# Altium project PCB_Interface_Inverter_UZ.PrjPcb
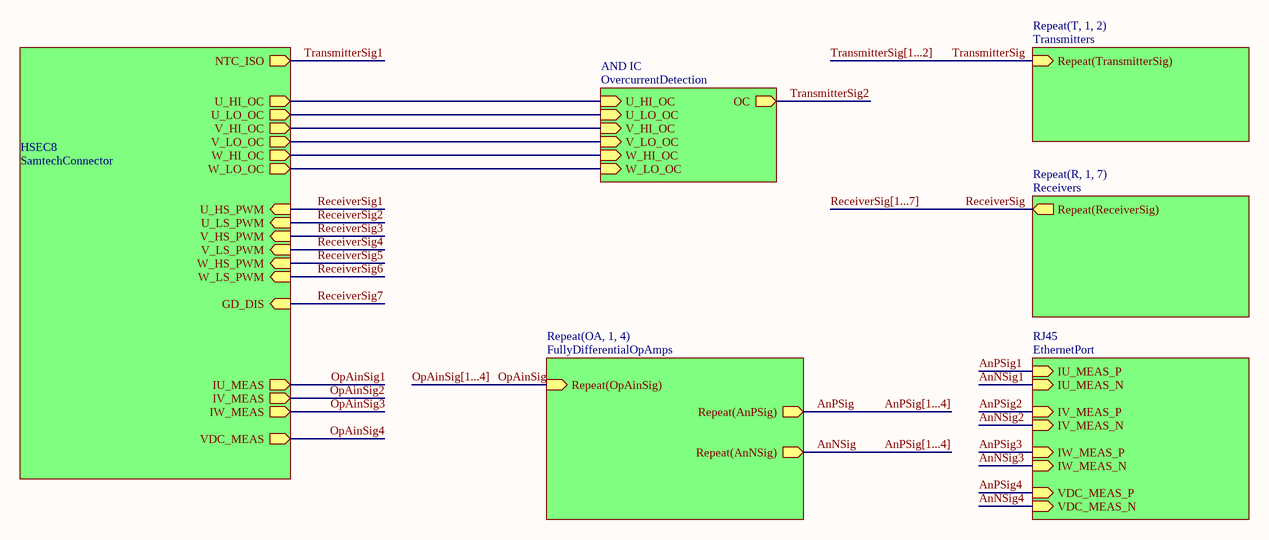
[diagram p0: TopSheet.SchDoc]
7 sheets, 111 parts. Net scope: hierarchical (ports join the sheet entries above them; power ports are global).
Board file: PCB.PcbDoc
Sheets:
  TopSheet.SchDoc
    HSEC8 = SamtechConnector.SchDoc
    OA1 = FullyDifferentialOpAmps.SchDoc
    OA2 = FullyDifferentialOpAmps.SchDoc
    OA3 = FullyDifferentialOpAmps.SchDoc
    OA4 = FullyDifferentialOpAmps.SchDoc
    T1 = Transmitters.SchDoc
    T2 = Transmitters.SchDoc
    AND IC = OvercurrentDetection.SchDoc
    R1 = Receivers.SchDoc
    R2 = Receivers.SchDoc
    R3 = Receivers.SchDoc
    R4 = Receivers.SchDoc
    R5 = Receivers.SchDoc
    R6 = Receivers.SchDoc
    R7 = Receivers.SchDoc
    RJ45 = EthernetPort.SchDoc

## Sheet TopSheet.SchDoc
size A4; SheetNumber: 1; SheetTotal: 7

### Sub-sheets
AND IC = OvercurrentDetection: U_HI_OC (in), U_LO_OC (in), V_HI_OC (in), V_LO_OC (in), W_HI_OC (in), OC (out), W_LO_OC (in)
HSEC8 = SamtechConnector: NTC_ISO (out), U_HI_OC (out), U_LO_OC (out), V_HI_OC (out), V_LO_OC (out), W_HI_OC (out), W_LO_OC (out), IU_MEAS (out), U_HS_PWM (in), U_LS_PWM (in), V_HS_PWM (in), V_LS_PWM (in), W_HS_PWM (in), W_LS_PWM (in), GD_DIS (in), IV_MEAS (out), IW_MEAS (out), VDC_MEAS (out)
Repeat(OA, 1, 4) = FullyDifferentialOpAmps: Repeat(OpAinSig) (in), Repeat(AnPSig) (out), Repeat(AnNSig) (out)
Repeat(R, 1, 7) = Receivers: Repeat(ReceiverSig) (out)
Repeat(T, 1, 2) = Transmitters: Repeat(TransmitterSig) (in)
RJ45 = EthernetPort: IU_MEAS_P (in), IU_MEAS_N (in), IV_MEAS_P (in), IV_MEAS_N (in), IW_MEAS_P (in), IW_MEAS_N (in), VDC_MEAS_P (in), VDC_MEAS_N (in)

### Nets
AnNSig: sheet Repeat(OA, 1, 4)/Repeat(AnNSig)  [also labelled AnPSig[1...4]]
AnPSig: sheet Repeat(OA, 1, 4)/Repeat(AnPSig)
OpAinSig: sheet Repeat(OA, 1, 4)/Repeat(OpAinSig)
ReceiverSig: sheet Repeat(R, 1, 7)/Repeat(ReceiverSig)
TransmitterSig: sheet Repeat(T, 1, 2)/Repeat(TransmitterSig)
NetJ1_79: sheet HSEC8/U_HI_OC, sheet AND IC/U_HI_OC
NetJ1_81: sheet HSEC8/U_LO_OC, sheet AND IC/U_LO_OC
NetJ1_91: sheet HSEC8/V_HI_OC, sheet AND IC/V_HI_OC
NetJ1_93: sheet HSEC8/V_LO_OC, sheet AND IC/V_LO_OC
NetJ1_99: sheet HSEC8/W_HI_OC, sheet AND IC/W_HI_OC
NetJ1_101: sheet HSEC8/W_LO_OC, sheet AND IC/W_LO_OC

### Buses and harness runs
bus AnPSig[1...4]
bus OpAinSig[1...4]
bus ReceiverSig[1...7]
bus TransmitterSig[1...2]

## Sheet SamtechConnector.SchDoc
size A4; SheetNumber: 3; SheetTotal: 7
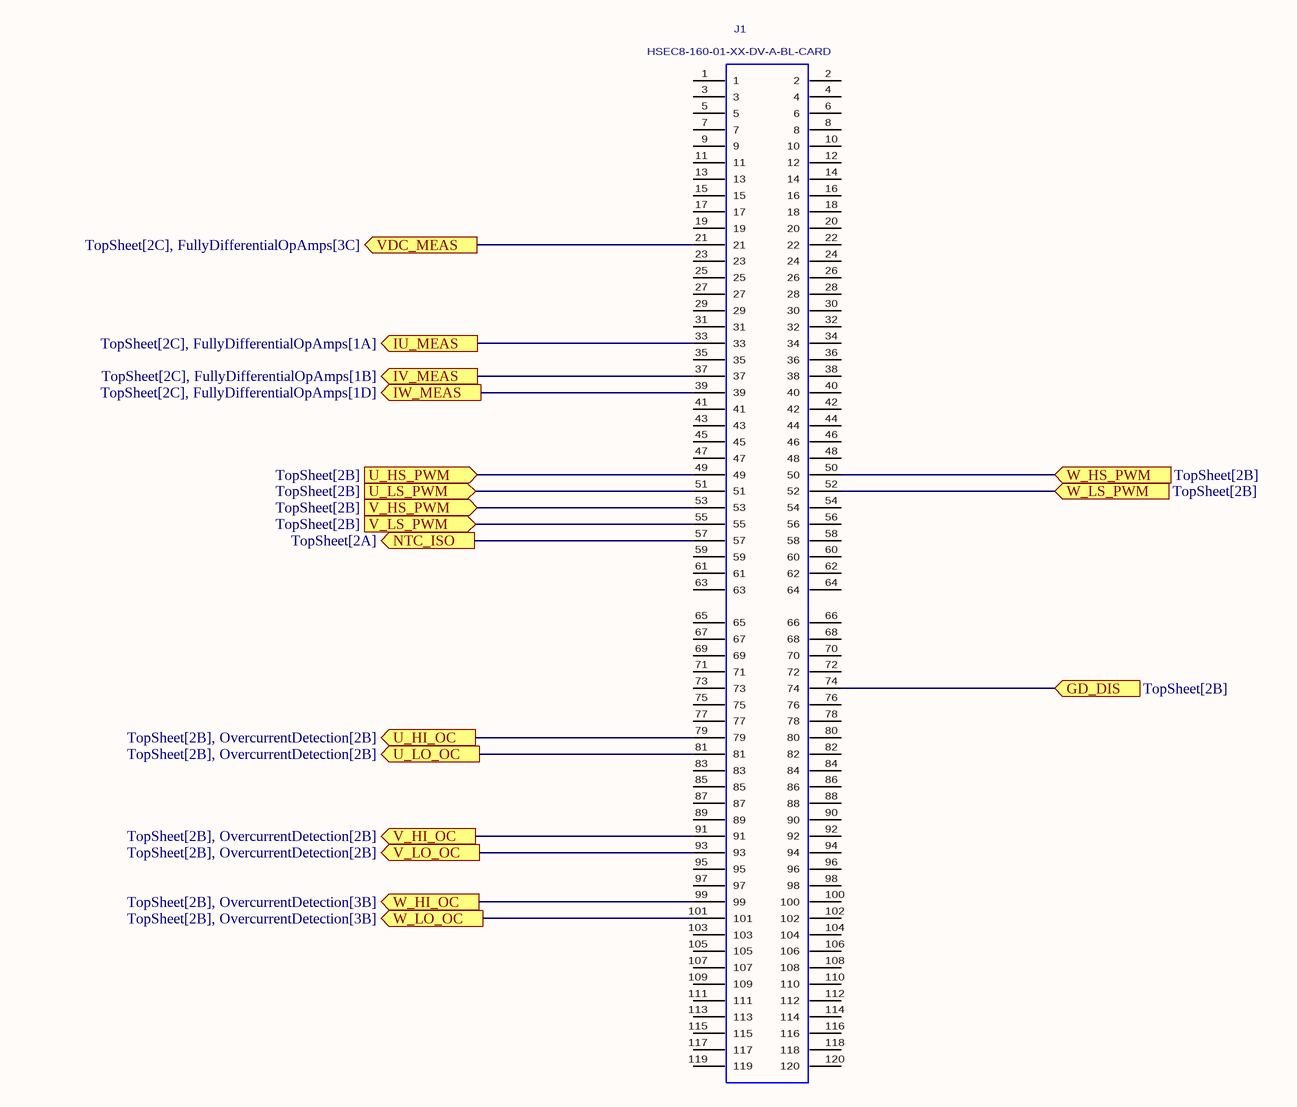
[diagram p1: SamtechConnector.SchDoc]

### Parts
J1  HSEC8-160-01-XX-DV-A-BL-CARD  [HSEC8-160-01-XX-DV-A-BL-CARD]

### Ports
GD_DIS (in, see TopSheet[2B]), IU_MEAS (out, see TopSheet[2C], FullyDifferentialOpAmps[1A]), IV_MEAS (out, see TopSheet[2C], FullyDifferentialOpAmps[1B]), IW_MEAS (out, see TopSheet[2C], FullyDifferentialOpAmps[1D]), NTC_ISO (out, see TopSheet[2A]), U_HI_OC (out, see TopSheet[2B], OvercurrentDetection[2B]), U_HS_PWM (in, see TopSheet[2B]), U_LO_OC (out, see TopSheet[2B], OvercurrentDetection[2B]), U_LS_PWM (in, see TopSheet[2B]), V_HI_OC (out, see TopSheet[2B], OvercurrentDetection[2B]), V_HS_PWM (in, see TopSheet[2B]), V_LO_OC (out, see TopSheet[2B], OvercurrentDetection[2B]), V_LS_PWM (in, see TopSheet[2B]), VDC_MEAS (out, see TopSheet[2C], FullyDifferentialOpAmps[3C]), W_HI_OC (out, see TopSheet[2B], OvercurrentDetection[3B]), W_HS_PWM (in, see TopSheet[2B]), W_LO_OC (out, see TopSheet[2B], OvercurrentDetection[3B]), W_LS_PWM (in, see TopSheet[2B])

### Nets
OpAinSig1: J1.33 ; port IU_MEAS
OpAinSig2: J1.37 ; port IV_MEAS
OpAinSig3: J1.39 ; port IW_MEAS
OpAinSig4: J1.21 ; port VDC_MEAS
ReceiverSig1: J1.49 ; port U_HS_PWM
ReceiverSig2: J1.51 ; port U_LS_PWM
ReceiverSig3: J1.53 ; port V_HS_PWM
ReceiverSig4: J1.55 ; port V_LS_PWM
ReceiverSig5: J1.50 ; port W_HS_PWM
ReceiverSig6: J1.52 ; port W_LS_PWM
ReceiverSig7: J1.74 ; port GD_DIS
TransmitterSig1: J1.57 ; port NTC_ISO
NetJ1_79: J1.79 ; port U_HI_OC
NetJ1_81: J1.81 ; port U_LO_OC
NetJ1_91: J1.91 ; port V_HI_OC
NetJ1_93: J1.93 ; port V_LO_OC
NetJ1_99: J1.99 ; port W_HI_OC
NetJ1_101: J1.101 ; port W_LO_OC

Not connected (* = marked no-connect by the designer): J1 1 2 3 4 5 6 7 8 9 10 11 12 13 14 15 16 17 18 19 20 22 23 24 25 26 27 28 29 30 31 32 34 35 36 38 40 41 42 43 44 45 46 47 48 54 56 58 59 60 61 62 63 64 65 66 67 68 69 70 71 72 73 75 76 77 78 80 82 83 84 85 86 87 88 89 90 92 94 95 96 97 98 100 102 103 104 105 106 107 108 109 110 111 112 113 114 115 116 117 118 119 120

### Library data of the parts
J1 = HSEC8-160-01-XX-DV-A-BL-CARD: MATING CARD LAYOUT FOR HSEC8-160-01-XX-DV-A-BL.; MANUFACTURER: SAMTEC; CREATED: April 20, 2018 - Wendy Xin; PCB DECAL: HSEC8-160-01-XX-DV-A-BL-CARD; Design Item ID: HSEC8-160-01-XX-DV-A-BL-CARD; Source: HSEC8-160-01-XX-DV-A-BL-CARD.SCHLIB; Component Type: Standard; Pin Count: 120

## Sheet FullyDifferentialOpAmps.SchDoc
size A4; SheetNumber: 2; SheetTotal: 7; SPICEModelCacheMURSBSRZ: <root> / <DocumentId>MURSBSRZ</DocumentId> / </root>
Used 4 times, as channels OA1, OA2, OA3, OA4. Parts and nets are listed once, with the designators drawn on the sheet.
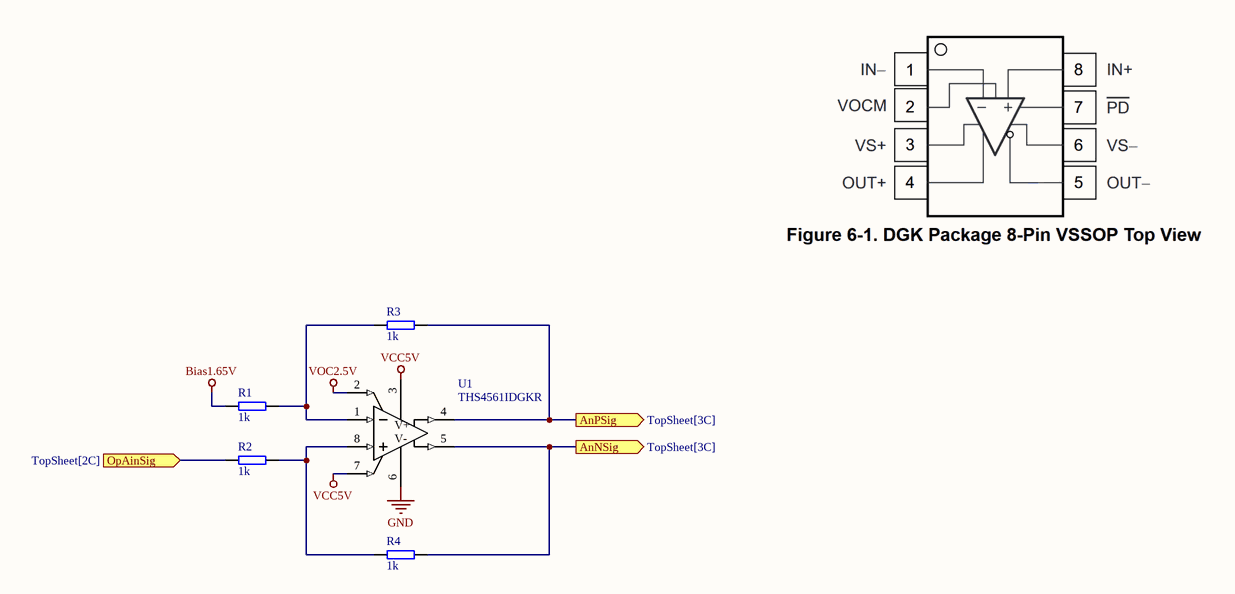
[diagram p2: FullyDifferentialOpAmps.SchDoc]

### Parts
R1  1k  [RES 0603_1608]
R2  1k  [RES 0603_1608]
R3  1k  [RES 0603_1608]
R4  1k  [RES 0603_1608]
U1  THS4561IDGKR  [DGK0008A_N]

### Ports
AnNSig (out, see TopSheet[3C]), AnPSig (out, see TopSheet[3C]), OpAinSig (in, see TopSheet[2C])

### Nets
Bias1.65V: R1.1
GND: U1.6(VS-)
VCC5V: U1.3(VS+) U1.7(PD_N)
VOC2.5V: U1.2(VOCM)
AnNSig: R4.2 U1.5(VOUT-) ; port AnNSig
AnPSig: R3.2 U1.4(VOUT+) ; port AnPSig
OpAinSig: R2.1 ; port OpAinSig
NetR1_2: R1.2 R3.1 U1.1(VIN-)
NetR2_2: R2.2 R4.1 U1.8(VIN+)

### Channels
OA1: designators end in _OA1; ports AnNSig=AnNSig1 AnPSig=AnPSig1 OpAinSig=OpAinSig1
OA2: designators end in _OA2; ports AnNSig=AnNSig2 AnPSig=AnPSig2 OpAinSig=OpAinSig2
OA3: designators end in _OA3; ports AnNSig=AnNSig3 AnPSig=AnPSig3 OpAinSig=OpAinSig3
OA4: designators end in _OA4; ports AnNSig=AnNSig4 AnPSig=AnPSig4 OpAinSig=OpAinSig4

### Notes on the sheet
- (in symbol CMP-020-000001-1) V+; V-

### Library data of the parts
R1-R4 = 0603WAF1001T5E: SMD resistor E24 series; Manufacturer: UNI-ROYAL; Tolerance: 1%; Created from: AGeiger; Manufacturer Part Number: 0603WAF1001T5E; PartID: 74; Created On: 14/12/2020 16:17:14; ComponentLink1Description: Datasheet; ComponentLink1URL: https://datasheet.lcsc.com/lcsc/2206010130_UNI-ROYAL-Uniroyal-Elec-0603WAF1001T5E_C21190.pdf; Component Type: SMD resistor; Device Package: 0603; Last Updated: 25/08/2022 16:01:46; Mounting Type: SMD; Supplier 1: LCSC; Supplier Part Number 1: C21190; Type: Resistor; Value: 1k; Live Cycle Status: 1; Stock number: Labor SMD Container; LCSC Part Number: C21190
U1 = CMP-020-000001-1: No Description Available; Mfr_Name: Texas Instruments; TYPE: TYPE; Source: THS4561IDGKR.SchLib; RefDes: RefDes; Design Item ID: THS4561IDGKR

## Sheet Transmitters.SchDoc
size A4; SheetNumber: 5; SheetTotal: 7
Used 2 times, as channels T1, T2. Parts and nets are listed once, with the designators drawn on the sheet.
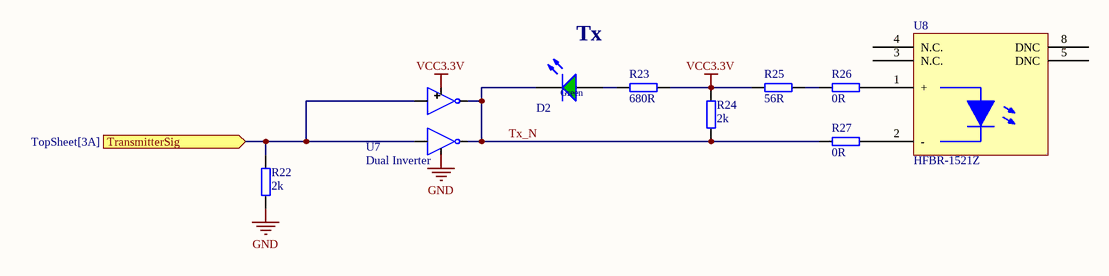
[diagram p3: Transmitters.SchDoc]

### Parts
D2  150060GS75000  [WL-SMCW_0603]  (value not drawn)
R22  2k  [R_0603_N]
R23  680R  [R_0603_N]
R24  2k  [R_0603_N]
R25  56R  [RES_2012X06N]
R26  0R  [R_0603_N]
R27  0R  [R_0603_N]
U7  Dual Inverter  [SN74LVC2GU04DCKR]
U8  HFBR-1521Z  [HFBRx5XX]

### Ports
TransmitterSig (in, see TopSheet[3A])

### Nets
GND: R22.1 U7.2(GND)
VCC3.3V: R23.1 R24.2 R25.1 U7.5(VCC)
TransmitterSig: R22.2 U7.1(IN1) U7.3(IN2) ; port TransmitterSig
Tx_N: D2.1(K) R24.1 R27.1 U7.4(OUT2) U7.6(OUT2)
NetD2_2: D2.2(A) R23.2
NetR25_2: R25.2 R26.1
NetR26_2: R26.2 U8.1(+)
NetR27_2: R27.2 U8.2(-)

Not connected (* = marked no-connect by the designer): U8 3(N.C.) 4(N.C.) 5(DNC) 8(DNC)

### Channels
T1: designators end in _T1; ports TransmitterSig=TransmitterSig1
T2: designators end in _T2; ports TransmitterSig=TransmitterSig2

### Notes on the sheet
- Tx

### Library data of the parts
D2 = LED_Green_0603: WL-SMCW SMD Mono-color Chip LED Waterclear, size 0603, Green, 3.2 V, 140°; Forward Voltage: 3.2 V; Luminous Intensity: 430 mcd; Peak Wavelength: 515 nm; Dominant Wavelength: 520 nm; MF: Wuerth Elektronik; Published Date: Sep. 2017; ComponentLink1Description: Manufacturer; ComponentLink1URL: http://www.we-online.de; ComponentLink2Description: Datasheet; ComponentLink2URL: http://katalog.we-online.com/led/datasheet/150060GS75000.pdf; MPN: 150060GS75000; Size: 0603; Viewing Angle: 140°; Emitting Color: Green; Value: 150060GS75000; Package: 0603; Created: 2018_09_06_AGeiger; Supplier 1: Farnell; Supplier Part Number 1: 2322070; Supplier 2: Mouser; Supplier Part Number 2: 710-150060GS75000; Supplier 3: Digi-Key; Supplier Part Number 3: 732-4971-1-ND; LCSC Part #: C72043
R22 R24 = R_0603: SMD Resistor 0603; MPN: RC0603FR-072KL; Tolerance: 1%; Voltage: 75 V; Power: 100 mW; MF: Yageo; Package: 0603; Value: 2k; Created: 2018_09_06_AGeiger; Supplier 1: Mouser; Supplier Part Number 1: 603-RC0603FR-072KL; LCSC Part #: C22975
R23 = R_0603: SMD Resistor 0603; MPN: CR0603-FX-3901ELF; Tolerance: 1%; Voltage: 75V; Power: 100 mW; MF: Bourns; Package: 0603; Value: 680R; Created: 2018_09_06_AGeiger; Supplier 1: Mouser; Supplier Part Number 1: 652-CR0603-FX3901ELF; LCSC Part #: C23228
R25 = R_0805: SMD Resistor 0805; MPN: CR0805-FX-1200ELF; Case_EIA: 0805; MF: Bourns; Voltage: 150 V; Power: 125 mW; Tolerance: 1%; Value: 56R; Supplier 1: Mouser; Supplier Part Number 1: 652-CR0805FX-1200ELF*; LCSC Part #: C17437
R26 R27 = R_0603_JLC: SMD Resistor 0603; Tolerance: 1%; Voltage: 75V; Power: 100 mW; Package: 0603; Value: 0R; Created: 2018_09_06_AGeiger; Supplier 1: Mouser; Supplier Part Number 1: 71-CRCW06030000Z0EBC; LCSC Part #: C21189
U7 = SN74LVC2GU04DCKR: This dual inverter is designed for 1.65-V to 5.5-V VCC / operation.; LCSC Part #: C116660; JLCSMT Rotation: 180
U8 = CMP-017-000002-1: Fibre Optic Transmitters, Link Horiz 5MBd Tx RoHS; MF: Broadcom/Avago; Supply Voltage: 5V; Wavelength: 660 nm; Foreward Current: 60 mA; Created: 2019_04_09_Kreppel; Data Rate: 5 MBd; Design Item ID: HFBR-1521Z; MPN: HFBR-1521Z; Source: UZOhm_Optical.SchLib

## Sheet OvercurrentDetection.SchDoc
size A4; SheetNumber: 7; SheetTotal: 7
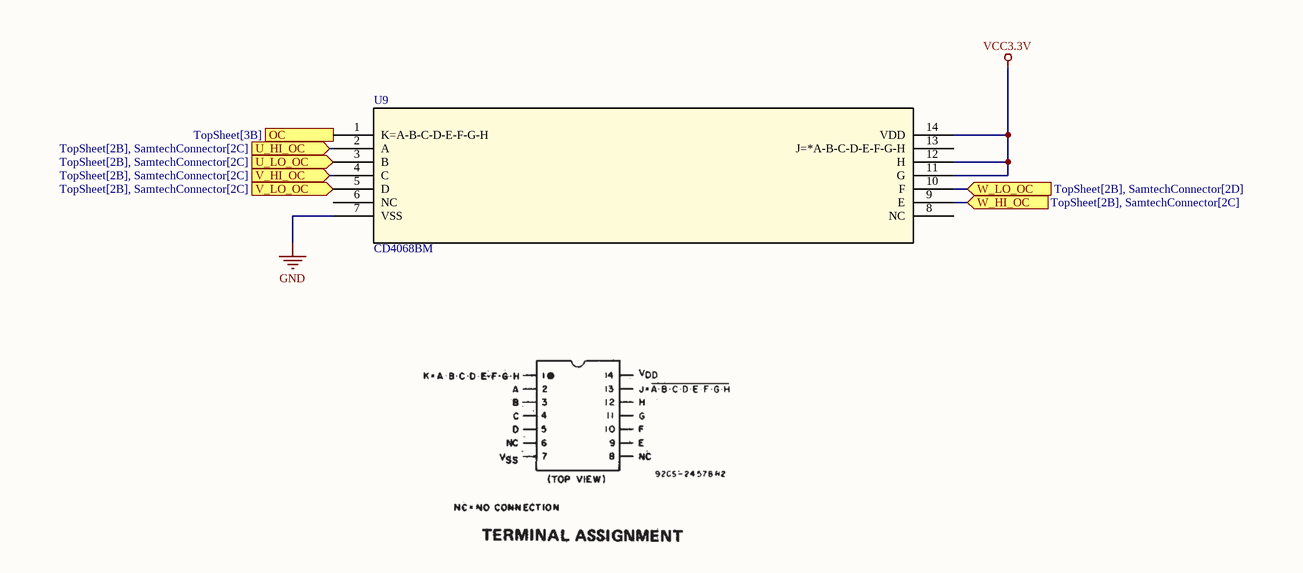
[diagram p4: OvercurrentDetection.SchDoc]

### Parts
U9  CD4068BM  [D14]

### Ports
OC (out, see TopSheet[3B]), U_HI_OC (in, see TopSheet[2B], SamtechConnector[2C]), U_LO_OC (in, see TopSheet[2B], SamtechConnector[2C]), V_HI_OC (in, see TopSheet[2B], SamtechConnector[2C]), V_LO_OC (in, see TopSheet[2B], SamtechConnector[2C]), W_HI_OC (in, see TopSheet[2B], SamtechConnector[2C]), W_LO_OC (in, see TopSheet[2B], SamtechConnector[2D])

### Nets
GND: U9.7(VSS)
VCC3.3V: U9.11(G) U9.12(H) U9.14(VDD)
TransmitterSig2: U9.1(K=A-B-C-D-E-F-G-H) ; port OC
NetJ1_79: U9.2(A) ; port U_HI_OC
NetJ1_81: U9.3(B) ; port U_LO_OC
NetJ1_91: U9.4(C) ; port V_HI_OC
NetJ1_93: U9.5(D) ; port V_LO_OC
NetJ1_99: U9.9(E) ; port W_HI_OC
NetJ1_101: U9.10(F) ; port W_LO_OC

Not connected (* = marked no-connect by the designer): U9 6(NC) 8(NC) 13(J=*A-B-C-D-E-F-G-H)

### Library data of the parts
U9 = CMP-023-000000-1: No Description Available; Mfr_Name: Texas Instruments; Type: Type; Source: CD4068BM.SchLib; Design Item ID: CD4068BM; RefDes: RefDes

## Sheet Receivers.SchDoc
size A4; SheetNumber: 4; SheetTotal: 7
Used 7 times, as channels R1, R2, R3, R4, R5, R6, R7. Parts and nets are listed once, with the designators drawn on the sheet.
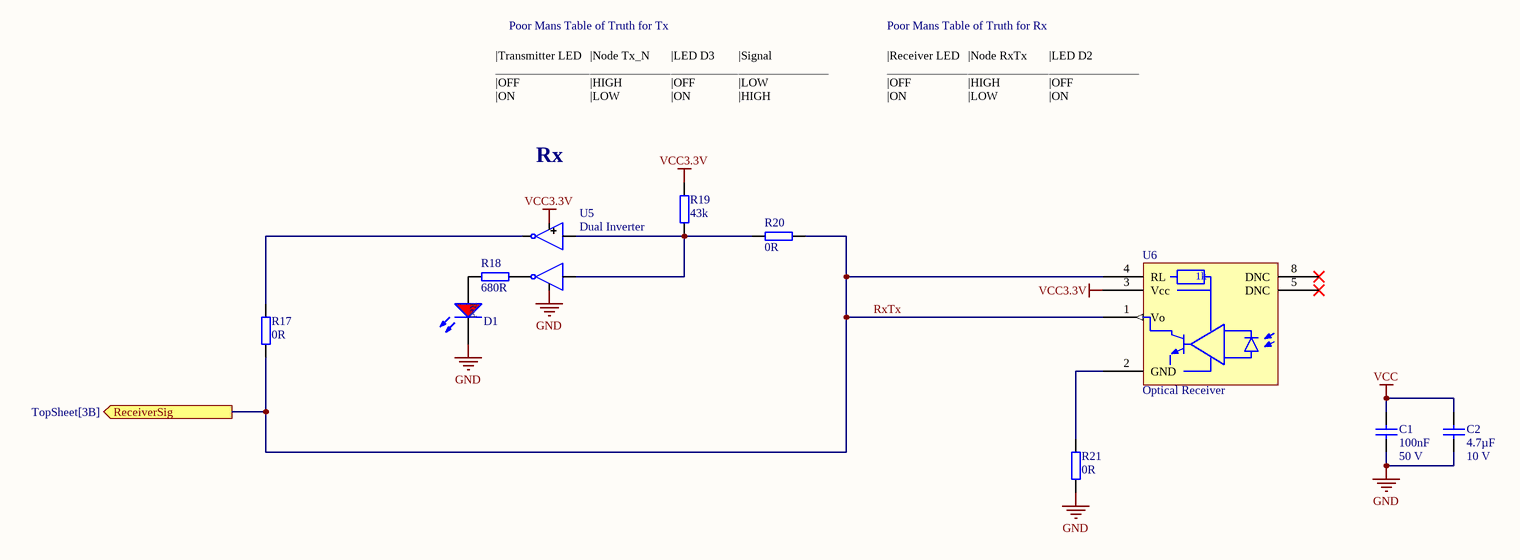
[diagram p5: Receivers.SchDoc]

### Parts
C1  Rated Voltage: 50 V  [C_0603(1608)100_L]  (hidden comment: 100nF)
C2  Voltage: 10 V  [CAP_2012X06N]  (hidden comment: 4.7µF)
D1  150060RS75000  [WL-SMCW_0603]  (value not drawn)
R17  0R  [R_0603_N]
R18  680R  [R_0603_N]
R19  43k  [R_0603_N]
R20  0R  [R_0603_N]
R21  0R  [R_0603_N]
U5  Dual Inverter  [SN74LVC2GU04DCKR]
U6  Optical Receiver  [HFBRx5XX]

### Ports
ReceiverSig (out, see TopSheet[3B])

### Nets
GND: C1.2 C2.2 D1.1(K) R21.2 U5.2(GND)
VCC: C1.1 C2.1
VCC3.3V: R19.1 U5.5(VCC) U6.3(Vcc)
RxTx: R17.1 R20.2 U6.1(Vo) U6.4(RL) ; port ReceiverSig
NetD1_2: D1.2(A) R18.2
NetR17_2: R17.2 U5.6(OUT2)
NetR18_1: R18.1 U5.4(OUT2)
NetR19_2: R19.2 R20.1 U5.1(IN1) U5.3(IN2)
NetR21_1: R21.1 U6.2(GND)

Not connected (* = marked no-connect by the designer): U6 5(DNC)* 8(DNC)*

### Channels
R1: designators end in _R1; ports ReceiverSig=ReceiverSig1
R2: designators end in _R2; ports ReceiverSig=ReceiverSig2
R3: designators end in _R3; ports ReceiverSig=ReceiverSig3
R4: designators end in _R4; ports ReceiverSig=ReceiverSig4
R5: designators end in _R5; ports ReceiverSig=ReceiverSig5
R6: designators end in _R6; ports ReceiverSig=ReceiverSig6
R7: designators end in _R7; ports ReceiverSig=ReceiverSig7

### Notes on the sheet
- Poor Mans Table of Truth for Tx
- Poor Mans Table of Truth for Rx
- |Transmitter LED
  _________________
  |OFF
  |ON
- |Node Tx_N
  _________________
  |HIGH
  |LOW
- |LED D3
  _______________
  |OFF
  |ON
- GATE
  _______
  LOW
  HIGH
- |Signal
  _______________
  |LOW
  |HIGH
- |Receiver LED
  ________________
  |OFF
  |ON
- |Node RxTx
  _________________
  |HIGH
  |LOW
- |LED D2
  _______________
  |OFF
  |ON
- Rx
- (in symbol HFBR-2528Z) 1k
- (in symbol HFBR-2521Z) 1k

### Library data of the parts
C1 = C_0603: CAP 0603 (1608 Metric) SMD; Tolerance: ±5%; Case-Metric: 1608; Case-EIA: 0603; Max Thickness: 1 mm; Technology: SMT; Created: 2018_09_06_AGeiger; Dielectric: *; Supplier 1: *; Supplier Part Number 1: *; MF: *; MPN: *; Value: 100nF; Package: 0603; LCSC Part #: C14663
C2 = C_0805: CAP 0805 (2012 Metric) SMD; MPN: LMF212B7475KGHT; Tolerance: ±10%; Case-Metric: 2012; Dielectric: X7R; MF: Taiyo Yuden; Case-EIA: 0805; Max Thickness: 1 mm; Technology: SMT; Created: 2018_09_06_AGeiger; Supplier 1: Mouser; Supplier Part Number 1: 963-LMF212B7475KGHT; Value: 4.7µF; Package: 0805; LCSC Part #: C1779
D1 = LED_Red_0603: WL-SMCW SMD Mono-color Chip LED Waterclear, size 0603, Red, 2 V, 140°; Forward Voltage: 2 V; Luminous Intensity: 250 mcd; Peak Wavelength: 630 nm; Dominant Wavelength: 625 nm; MF: Wuerth Elektronik; Published Date: Sep. 2017; ComponentLink1Description: Manufacturer; ComponentLink1URL: http://www.we-online.de; ComponentLink2Description: Datasheet; ComponentLink2URL: http://katalog.we-online.com/led/datasheet/150060RS75000.pdf; MPN: 150060RS75000; Size: 0603; Viewing Angle: 140°; Emitting Color: Red; Value: 150060RS75000; Package: 0603; Created: 2018_09_06_AGeiger; Supplier 1: Farnell; Supplier Part Number 1: 2322071; Supplier 2: Mouser; Supplier Part Number 2: 710-150060RS75000; Supplier 3: Digi-Key; Supplier Part Number 3: 732-4978-1-ND; LCSC Part #: C2286
R17 R20 = R_0603_JLC: as R26 on sheet Transmitters; Package: 0603; Value: 0R; Created: 2018_09_06_AGeiger; Supplier 1: Mouser; Supplier Part Number 1: 71-CRCW06030000Z0EBC; LCSC Part #: C21189
R18 = R_0603: as R23 on sheet Transmitters; Package: 0603; Value: 680R; Created: 2018_09_06_AGeiger; Supplier 1: Mouser; Supplier Part Number 1: 652-CR0603-FX3901ELF; LCSC Part #: C23228
R19 = R_0603_JLC: SMD Resistor 0603; Tolerance: 1%; Voltage: 50V; Power: 100 mW; Package: 0603; Value: 43k; Created: 2018_09_06_AGeiger; Supplier 1: *; Supplier Part Number 1: *; LCSC Part #: C23172
R21 = R_0603: SMD Resistor 0603; MPN: CRCW06030000Z0EBC; Tolerance: 1%; Voltage: 75V; Power: 100 mW; MF: Vishay; Package: 0603; Value: 0R; Created: 2018_09_06_AGeiger; Supplier 1: Mouser; Supplier Part Number 1: 71-CRCW06030000Z0EBC; LCSC Part #: C21189
U5 = SN74LVC2GU04DCKR: as U7 on sheet Transmitters; LCSC Part #: C116660; JLCSMT Rotation: 180
U6 = HFBR-2528Z: Fibre Optic Receivers, LINK HORIZ 5MBd RC VR RoHS; MPN: HFBR-2521Z; Suppier Part Number 2: 516-2062-ND; MF: Boadcom/Avago; Wavelength: 660 nm; Iout max: 25 mA; Supply Voltage: 5V; Created: 2019_04_09_Kreppel; Data Rate: 5 MBd; Supplier 1: Mouser; Supplier 2: Digi-Key; Supplier Part Number 1: 630-HFBR-2521Z

## Sheet EthernetPort.SchDoc
size A4; SheetNumber: 6; SheetTotal: 7
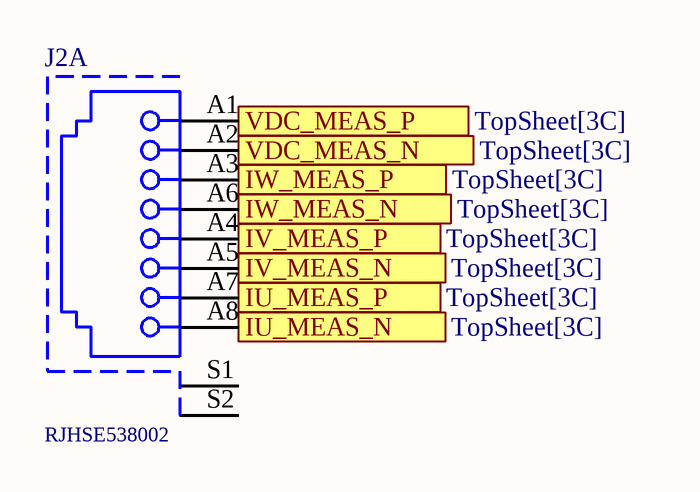
[diagram p6: EthernetPort.SchDoc]

### Parts
J2  RJHSE538002  [RJHSE-5380-02]  (part A of 2)

### Ports
IU_MEAS_N (in, see TopSheet[3C]), IU_MEAS_P (in, see TopSheet[3C]), IV_MEAS_N (in, see TopSheet[3C]), IV_MEAS_P (in, see TopSheet[3C]), IW_MEAS_N (in, see TopSheet[3C]), IW_MEAS_P (in, see TopSheet[3C]), VDC_MEAS_N (in, see TopSheet[3C]), VDC_MEAS_P (in, see TopSheet[3C])

### Nets
AnNSig1: J2.A8 ; port IU_MEAS_N
AnNSig2: J2.A5 ; port IV_MEAS_N
AnNSig3: J2.A6 ; port IW_MEAS_N
AnNSig4: J2.A2 ; port VDC_MEAS_N
AnPSig1: J2.A7 ; port IU_MEAS_P
AnPSig2: J2.A4 ; port IV_MEAS_P
AnPSig3: J2.A3 ; port IW_MEAS_P
AnPSig4: J2.A1 ; port VDC_MEAS_P

Not connected (* = marked no-connect by the designer): J2 S1 S2

### Library data of the parts
J2 = RJHSE538002: CAT5, RJ45 Connector, 1x2; Manufacturer: Amphenol; Created from: MGremer; Manufacturer Part Number: RJHSE538002; PartID: 4; Created On: 22/02/2021 16:43:38; ComponentLink1Description: Datasheet; ComponentLink1URL: https://www.farnell.com/cad/2360382.pdf; Component Type: RJ45 Connector; Device Package: RJ45; Last Updated: 22/02/2021 16:43:38; Mounting Type: THT; Series: RJHSE; Supplier 1: Farnell; Supplier Part Number 1: 1860605; Type: RJ45 Connector; Live Cycle Status: 1; Stock number: not stored

## Nets that join several sheets
Bias1.65V: OA1 (R1_OA1.1), OA2 (R1_OA2.1), OA3 (R1_OA3.1), OA4 (R1_OA4.1)
GND: OA1 (U1_OA1.6), OA2 (U1_OA2.6), OA3 (U1_OA3.6), OA4 (U1_OA4.6), T1 (R22_T1.1 U7_T1.2), T2 (R22_T2.1 U7_T2.2), OvercurrentDetection (U9.7), R1 (5 pins), R2 (5 pins), R3 (5 pins), R4 (5 pins), R5 (5 pins), R6 (5 pins), R7 (5 pins)
VCC: R1 (C1_R1.1 C2_R1.1), R2 (C1_R2.1 C2_R2.1), R3 (C1_R3.1 C2_R3.1), R4 (C1_R4.1 C2_R4.1), R5 (C1_R5.1 C2_R5.1), R6 (C1_R6.1 C2_R6.1), R7 (C1_R7.1 C2_R7.1)
VCC3.3V: T1 (R23_T1.1 R24_T1.2 R25_T1.1 U7_T1.5), T2 (R23_T2.1 R24_T2.2 R25_T2.1 U7_T2.5), OvercurrentDetection (U9.11 U9.12 U9.14), R1 (R19_R1.1 U5_R1.5 U6_R1.3), R2 (R19_R2.1 U5_R2.5 U6_R2.3), R3 (R19_R3.1 U5_R3.5 U6_R3.3), R4 (R19_R4.1 U5_R4.5 U6_R4.3), R5 (R19_R5.1 U5_R5.5 U6_R5.3), R6 (R19_R6.1 U5_R6.5 U6_R6.3), R7 (R19_R7.1 U5_R7.5 U6_R7.3)
VCC5V: OA1 (U1_OA1.3 U1_OA1.7), OA2 (U1_OA2.3 U1_OA2.7), OA3 (U1_OA3.3 U1_OA3.7), OA4 (U1_OA4.3 U1_OA4.7)
VOC2.5V: OA1 (U1_OA1.2), OA2 (U1_OA2.2), OA3 (U1_OA3.2), OA4 (U1_OA4.2)
AnNSig1: OA1 (R4_OA1.2 U1_OA1.5), EthernetPort (J2.A8)
AnNSig2: OA2 (R4_OA2.2 U1_OA2.5), EthernetPort (J2.A5)
AnNSig3: OA3 (R4_OA3.2 U1_OA3.5), EthernetPort (J2.A6)
AnNSig4: OA4 (R4_OA4.2 U1_OA4.5), EthernetPort (J2.A2)
AnPSig1: OA1 (R3_OA1.2 U1_OA1.4), EthernetPort (J2.A7)
AnPSig2: OA2 (R3_OA2.2 U1_OA2.4), EthernetPort (J2.A4)
AnPSig3: OA3 (R3_OA3.2 U1_OA3.4), EthernetPort (J2.A3)
AnPSig4: OA4 (R3_OA4.2 U1_OA4.4), EthernetPort (J2.A1)
NetJ1_79: SamtechConnector (J1.79), OvercurrentDetection (U9.2)
NetJ1_81: SamtechConnector (J1.81), OvercurrentDetection (U9.3)
NetJ1_91: SamtechConnector (J1.91), OvercurrentDetection (U9.4)
NetJ1_93: SamtechConnector (J1.93), OvercurrentDetection (U9.5)
NetJ1_99: SamtechConnector (J1.99), OvercurrentDetection (U9.9)
NetJ1_101: SamtechConnector (J1.101), OvercurrentDetection (U9.10)
OpAinSig1: SamtechConnector (J1.33), OA1 (R2_OA1.1)
OpAinSig2: SamtechConnector (J1.37), OA2 (R2_OA2.1)
OpAinSig3: SamtechConnector (J1.39), OA3 (R2_OA3.1)
OpAinSig4: SamtechConnector (J1.21), OA4 (R2_OA4.1)
ReceiverSig1: SamtechConnector (J1.49), R1 (R17_R1.1 R20_R1.2 U6_R1.1 U6_R1.4)
ReceiverSig2: SamtechConnector (J1.51), R2 (R17_R2.1 R20_R2.2 U6_R2.1 U6_R2.4)
ReceiverSig3: SamtechConnector (J1.53), R3 (R17_R3.1 R20_R3.2 U6_R3.1 U6_R3.4)
ReceiverSig4: SamtechConnector (J1.55), R4 (R17_R4.1 R20_R4.2 U6_R4.1 U6_R4.4)
ReceiverSig5: SamtechConnector (J1.50), R5 (R17_R5.1 R20_R5.2 U6_R5.1 U6_R5.4)
ReceiverSig6: SamtechConnector (J1.52), R6 (R17_R6.1 R20_R6.2 U6_R6.1 U6_R6.4)
ReceiverSig7: SamtechConnector (J1.74), R7 (R17_R7.1 R20_R7.2 U6_R7.1 U6_R7.4)
TransmitterSig1: SamtechConnector (J1.57), T1 (R22_T1.2 U7_T1.1 U7_T1.3)
TransmitterSig2: T2 (R22_T2.2 U7_T2.1 U7_T2.3), OvercurrentDetection (U9.1)